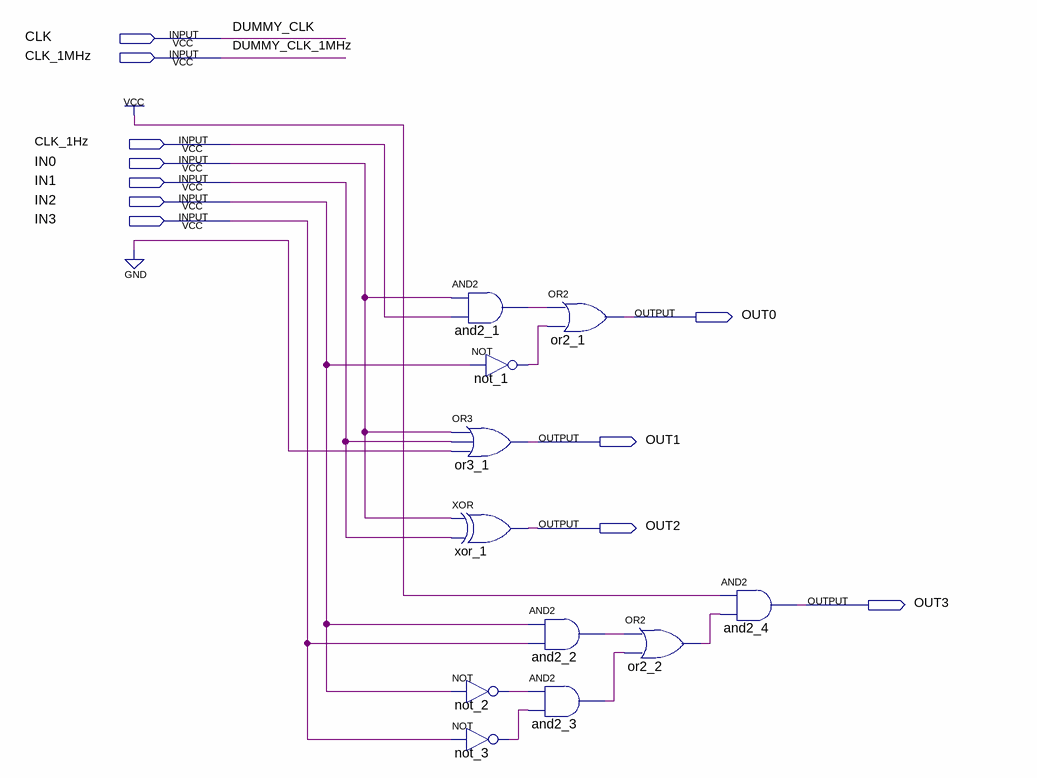
[diagram p0: schematic sheet]
// Quartus schematic BLOCK_DIAGRAM_FINAL.bdf as structural Verilog: 11 symbols, 11 pins
module BLOCK_DIAGRAM_FINAL (
  input  CLK,
  input  CLK_1MHz,
  input  CLK_1Hz,
  input  IN0,
  input  IN1,
  input  IN2,
  input  IN3,
  output OUT0,
  output OUT1,
  output OUT2,
  output OUT3
);

  wire and2_1_out, and2_2_out, and2_3_out, not_1_out, not_2_out, not_3_out, or2_2_out;

  and and2_1 (and2_1_out, IN0, CLK_1Hz);
  not not_1 (not_1_out, IN2);
  or or3_1 (OUT1, IN0, IN1, 1'b0);
  xor xor_1 (OUT2, IN0, IN1);
  not not_2 (not_2_out, IN2);
  not not_3 (not_3_out, IN3);
  or or2_1 (OUT0, and2_1_out, not_1_out);
  and and2_2 (and2_2_out, IN2, IN3);
  and and2_3 (and2_3_out, not_2_out, not_3_out);
  or or2_2 (or2_2_out, and2_2_out, and2_3_out);
  and and2_4 (OUT3, 1'b1, or2_2_out);

  // Other names for the same wires on the sheet: DUMMY_CLK = CLK; DUMMY_CLK_1MHz = CLK_1MHz
endmodule
